# Altium project Division Watch.PrjPcb
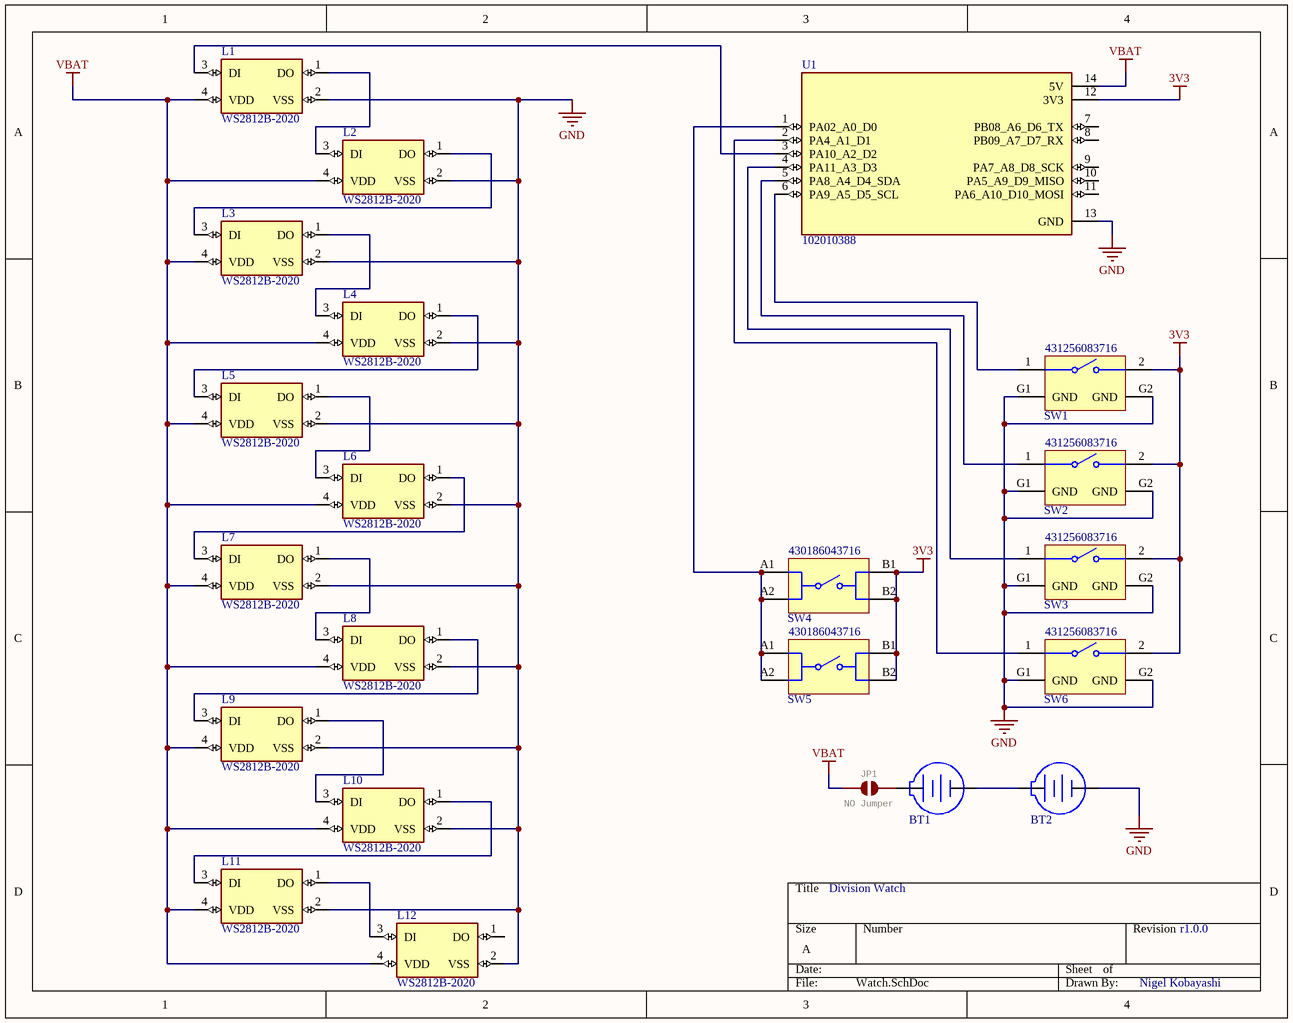
[diagram p0: Watch.SchDoc]
1 sheet, 22 parts. Net scope: global (net labels, ports and power ports of the same name join across sheets).
Board file: Watch.PcbDoc

## Sheet Watch.SchDoc
size A; SheetNumber: 1; SheetTotal: 1

### Parts
BT1  79523141  [79523141]  (value not drawn)
BT2  79523141  [79523141]  (value not drawn)
JP1  NO Jumper  [SMT-JUMPER_2_NO_SILK]
L1  WS2812B-2020  [WS2812B-2020]
L2  WS2812B-2020  [WS2812B-2020]
L3  WS2812B-2020  [WS2812B-2020]
L4  WS2812B-2020  [WS2812B-2020]
L5  WS2812B-2020  [WS2812B-2020]
L6  WS2812B-2020  [WS2812B-2020]
L7  WS2812B-2020  [WS2812B-2020]
L8  WS2812B-2020  [WS2812B-2020]
L9  WS2812B-2020  [WS2812B-2020]
L10  WS2812B-2020  [WS2812B-2020]
L11  WS2812B-2020  [WS2812B-2020]
L12  WS2812B-2020  [WS2812B-2020]
SW1  431256083716  [4312560837x6]
SW2  431256083716  [4312560837x6]
SW3  431256083716  [4312560837x6]
SW4  430186043716  [4301x60437x6]
SW5  430186043716  [4301x60437x6]
SW6  431256083716  [4312560837x6]
U1  102010388  [MODULE_102010388]

### Nets
3V3: SW1.2 SW2.2 SW3.2 SW4.B1 SW4.B2 SW5.B1 SW5.B2 SW6.2 U1.12(3V3)
GND: BT2.2(-) L1.2(VSS) L2.2(VSS) L3.2(VSS) L4.2(VSS) L5.2(VSS) L6.2(VSS) L7.2(VSS) L8.2(VSS) L9.2(VSS) L10.2(VSS) L11.2(VSS) L12.2(VSS) SW1.G1(GND) SW1.G2(GND) SW2.G1(GND) SW2.G2(GND) SW3.G1(GND) SW3.G2(GND) SW6.G1(GND) SW6.G2(GND) U1.13(GND)
VBAT: JP1.1 L1.4(VDD) L2.4(VDD) L3.4(VDD) L4.4(VDD) L5.4(VDD) L6.4(VDD) L7.4(VDD) L8.4(VDD) L9.4(VDD) L10.4(VDD) L11.4(VDD) L12.4(VDD) U1.14(5V)
NetBT1_1: BT1.1(+) JP1.2
NetBT1_2: BT1.2(-) BT2.1(+)
NetL1_1: L1.1(DO) L2.3(DI)
NetL1_3: L1.3(DI) U1.3(PA10_A2_D2)
NetL2_1: L2.1(DO) L3.3(DI)
NetL3_1: L3.1(DO) L4.3(DI)
NetL4_1: L4.1(DO) L5.3(DI)
NetL5_1: L5.1(DO) L6.3(DI)
NetL6_1: L6.1(DO) L7.3(DI)
NetL7_1: L7.1(DO) L8.3(DI)
NetL8_1: L8.1(DO) L9.3(DI)
NetL9_1: L9.1(DO) L10.3(DI)
NetL10_1: L10.1(DO) L11.3(DI)
NetL11_1: L11.1(DO) L12.3(DI)
NetSW1_1: SW1.1 U1.6(PA9_A5_D5_SCL)
NetSW2_1: SW2.1 U1.5(PA8_A4_D4_SDA)
NetSW3_1: SW3.1 U1.4(PA11_A3_D3)
NetSW4_A1: SW4.A1 SW4.A2 SW5.A1 SW5.A2 U1.1(PA02_A0_D0)
NetSW6_1: SW6.1 U1.2(PA4_A1_D1)

Not connected (* = marked no-connect by the designer): L12 1(DO); U1 7(PB08_A6_D6_TX) 8(PB09_A7_D7_RX) 9(PA7_A8_D8_SCK) 10(PA5_A9_D9_MISO) 11(PA6_A10_D10_MOSI)

### Notes on the sheet
- Division Watch
- r1.0.0
- Nigel Kobayashi

### Library data of the parts
BT1 BT2 = 79523141: WA-BCMC Battery Holder, SMT, battery type 2016,2020,2025,2032; Manufacturer: Wurth Elektronik; Manufacturer Part Number: 79523141; Category: Battery Holders; Match Code: WA-BCMC; ComponentLink1Description: Website Link; ComponentLink1URL: https://www.we-online.com/redexpert/article/79523141?ad; ComponentLink2Description: Datasheet Link; ComponentLink2URL: https://www.we-online.com/redexpert/spec/79523141?ad; Mount: Surface Mount; Operating Temperature Max: 85°C; Operating Temperature Min: -30°C; Packaging: Tape and Reel; Battery Type: 2016,2020,2025,2032
JP1 = JUMPER-SMT_2_NO_SILK: GateName_1: G$1; SymbolName_1: SMT-JUMPER_2_NO; DeviceName: _SILK; LibraryName: SparkFun-Jumpers; DeviceSetName: JUMPER-SMT_2_NO; Package: SMT-JUMPER_2_NO_SILK
L1-L12 = WS2812B-2020: Programmable LED; SMD; 2020; RGB; 2x2x0.84mm; 3.7Ã·5.3V; 2kHz; MF: WorldSemi; SnapEDA_Link: https://www.snapeda.com/parts/WS2812B-2020/Worldsemi/view-part/?ref=snap; Package: None; Value: *; MP: WS2812B-2020; Check_prices: https://www.snapeda.com/parts/WS2812B-2020/Worldsemi/view-part/?ref=eda
SW1-SW3 SW6 = 431256083716: WS-TATU THT Tact Switch 6x6mm Right Angled Type with ground terminal, SPST-NO, 12VDC, 50mA, 160g; Manufacturer: Wurth Elektronik; Washable: No; Manufacturer Part Number: 431256083716; Category: Tact Switches; Match Code: WS-TATU; ComponentLink1Description: Website Link; ComponentLink1URL: https://www.we-online.com/redexpert/article/431256083716?ad; ComponentLink2Description: Datasheet Link; ComponentLink2URL: https://www.we-online.com/redexpert/spec/431256083716?ad; Mount: Through Hole; Operating Temperature Max: 85°C; Operating Temperature Min: -40°C; Packaging: Bulk; Length: 6mm; Width: 6mm; Height: 8.35mm; Circuit: SPST-NO; Contact Material: Stainless Steel; Contact Plating: Silver; Operation Force: 160g; Rated Current: 50mA; Rated Voltage (DC): 12VDC; Terminal Material: Copper Alloy; Terminal Plating: Silver
SW4 SW5 = 430186043716: WS-TATV THT Tact Switch 6x6mm, SPST-NO, 12VDC, 50mA, 160g; Manufacturer: Wurth Elektronik; Washable: No; Manufacturer Part Number: 430186043716; Category: Tact Switches; Match Code: WS-TATV; ComponentLink1Description: Website Link; ComponentLink1URL: https://www.we-online.com/redexpert/article/430186043716?ad; ComponentLink2Description: Datasheet Link; ComponentLink2URL: https://www.we-online.com/redexpert/spec/430186043716?ad; Mount: Through Hole; Operating Temperature Max: 85°C; Operating Temperature Min: -40°C; Packaging: Bulk; Length: 6mm; Width: 6mm; Height: 4.3mm; Circuit: SPST-NO; Contact Material: Stainless Steel; Contact Plating: Silver; Operation Force: 160g; Rated Current: 50mA; Rated Voltage (DC): 12VDC; Terminal Material: Copper Alloy; Terminal Plating: Silver
U1 = 102010388: Seeeduino XIAO Development Board, Pre-Soldered [Seeed Studio] 102010388 Seeeduino XIAO Development Board, Pre-Soldered; MF: Seeed Technology Co., Ltd; Price: None; Availability: In Stock; Check_prices: https://www.snapeda.com/parts/102010388/Seeed+Technology+Co.%252C+Ltd/view-part/?ref=eda; MP: 102010388; Package: None; SnapEDA_Link: https://www.snapeda.com/parts/102010388/Seeed+Technology+Co.%252C+Ltd/view-part/?ref=snap; Value: *; Purchase-URL: https://pricing.snapeda.com/search/part/102010388/?ref=eda